# EAGLE schematic ERAM100 (EAGLE 9.2.0)
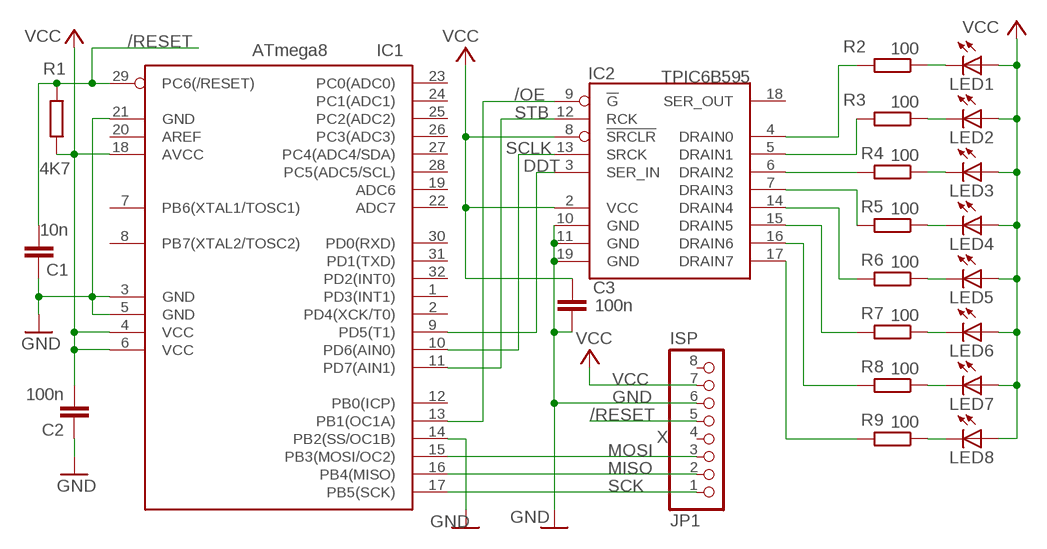
[diagram p0: schematic, sheet 1]

## Parts
C1  10n  C-EUC0805  [C0805]
C2  100n  C-EUC0805  [C0805]
C3  100n  C-EUC0805  [C0805]
IC1  ATmega8  MEGA8-AI  [TQFP32-08]
IC2  TPIC6B595  TPIC6B595DW  [SO20W]
JP1  ISP  PINHD-1X8BIG  [1X08-BIG]
LED1  LED3MM  [LED3MM]
LED2  LED3MM  [LED3MM]
LED3  LED3MM  [LED3MM]
LED4  LED3MM  [LED3MM]
LED5  LED3MM  [LED3MM]
LED6  LED3MM  [LED3MM]
LED7  LED3MM  [LED3MM]
LED8  LED3MM  [LED3MM]
R1  4K7  R-EU_R0805  [R0805]
R2  100  R-EU_R0805  [R0805]
R3  100  R-EU_R0805  [R0805]
R4  100  R-EU_R0805  [R0805]
R5  100  R-EU_R0805  [R0805]
R6  100  R-EU_R0805  [R0805]
R7  100  R-EU_R0805  [R0805]
R8  100  R-EU_R0805  [R0805]
R9  100  R-EU_R0805  [R0805]

## Nets
/OE: IC1.13(PB1(OC1A)) IC2.9(!G)
/RESET: C1.2 IC1.29(PC6(/RESET)) JP1.5 R1.2
DDT: IC1.9(PD5(T1)) IC2.3(SER_IN)
GND: C1.1 C2.1 C3.1 IC1.3(GND) IC1.5(GND) IC1.14(PB2(SS/OC1B)) IC1.21(GND) IC2.10(GND) IC2.11(GND) IC2.19(GND) JP1.6
MISO: IC1.16(PB4(MISO)) JP1.2
MOSI: IC1.15(PB3(MOSI/OC2)) JP1.3
N$5: LED1.K(C) R2.1
N$6: LED2.K(C) R3.1
N$7: LED3.K(C) R4.1
N$8: LED4.K(C) R5.1
N$9: LED5.K(C) R6.1
N$10: LED6.K(C) R7.1
N$11: LED7.K(C) R8.1
N$12: LED8.K(C) R9.1
N$13: IC2.17(DRAIN7) R9.2
N$14: IC2.16(DRAIN6) R8.2
N$15: IC2.15(DRAIN5) R7.2
N$16: IC2.14(DRAIN4) R6.2
N$17: IC2.7(DRAIN3) R5.2
N$18: IC2.6(DRAIN2) R4.2
N$19: IC2.5(DRAIN1) R3.2
N$20: IC2.4(DRAIN0) R2.2
SCK: IC1.17(PB5(SCK)) JP1.1
SCLK: IC1.10(PD6(AIN0)) IC2.13(SRCK)
STB: IC1.11(PD7(AIN1)) IC2.12(RCK)
VCC: C2.2 C3.2 IC1.4(VCC) IC1.6(VCC) IC1.18(AVCC) IC2.2(VCC) IC2.8(!SRCLR) JP1.7 LED1.A LED2.A LED3.A LED4.A LED5.A LED6.A LED7.A LED8.A R1.1
Unconnected: IC1.1(PD3(INT1)) IC1.2(PD4(XCK/T0)) IC1.7(PB6(XTAL1/TOSC1)) IC1.8(PB7(XTAL2/TOSC2)) IC1.12(PB0(ICP)) IC1.19(ADC6) IC1.20(AREF) IC1.22(ADC7) IC1.23(PC0(ADC0)) IC1.24(PC1(ADC1)) IC1.25(PC2(ADC2)) IC1.26(PC3(ADC3)) IC1.27(PC4(ADC4/SDA)) IC1.28(PC5(ADC5/SCL)) IC1.30(PD0(RXD)) IC1.31(PD1(TXD)) IC1.32(PD2(INT0)) IC2.18(SER_OUT) JP1.4 JP1.8

## Notes on the sheet
- X

## Library data of the parts
C1-C3 = rcl:C-EU: CAPACITOR, European symbol; SPICEPREFIX: C
IC1 = atmel:MEGA8: MICROCONTROLLER 8 Kbytes FLASH, 1 kbytes SRAM, 512 bytes EEPROM, USART, 6-channel 10 bit ADC, 2-channel 8 bit ADC Pin compatible with Atmega48, ATMega88, ATMega168 Source: avr.lbr; MPN: ATMEGA8-16AU; OC_FARNELL: 9171371; OC_NEWARK: 73M8863
IC2 = TPIC6B595:TPIC6B595
JP1 = adafruit:PINHD-1X8: PIN HEADER
LED1-LED8 = adafruit:LED: LED OSRAM: - CHIPLED LG R971, LG N971, LY N971, LG Q971, LY Q971, LO R971, LY R971 LH N974, LH R974 LS Q976, LO Q976, LY Q976 LO Q996 - Hyper CHIPLED LW Q18S LB Q993, LB Q99A, LB R99A - SideLED LS A670, LO A670, LY A670, LG A670, LP A670 LB A673, LV A673, LT A673, LW A673 LH A674 LY A675 LS A676, LA A676, LO A676, LY A676, LW A676 LS A679, LY A679, LG A679 - Hyper Micro SIDELED® LS Y876, LA Y876, LO Y876, LY Y876 LT Y87S - SmartLED LW L88C, LW L88S LB L89C, LB L89S, LG L890 LS L89K, LO L89K, LY L89K LS L896, LA L896, LO L896, LY L896 - TOPLED LS T670, LO T670, LY T670, LG T670, LP T670 LSG T670, LSP T670, LSY T670, LOP T670, LYG T670 LG T671, LOG T671, LSG T671 LB T673, LV T673, LT T673, LW T673 LH T674 LS T676, LA T676, LO T676, LY T676, LB T676, LH T676, LSB T676, LW T676 LB T67C, LV T67C, LT T67C, LS T67K, LO T67K, LY T67K, LW E67C LS E67B, LA E67B, LO E67B, LY E67B, LB E67C, LV E67C, LT E67C LW T67C LS T679, LY T679, LG T679 LS T770, LO T770, LY T770, LG T770, LP T770 LB T773, LV T773, LT T773, LW T773 LH T774 LS E675, LA E675, LY E675, LS T675 LS T776, LA T776, LO T776, LY T776, LB T776 LHGB T686 LT T68C, LB T68C - Hyper Mini TOPLED® LB M676 - Mini TOPLED Santana® LG M470 LS M47K, LO M47K, LY M47K Source: http://www.osram.convergy.de/
R1-R9 = rcl:R-EU_: RESISTOR, European symbol; SPICEPREFIX: R